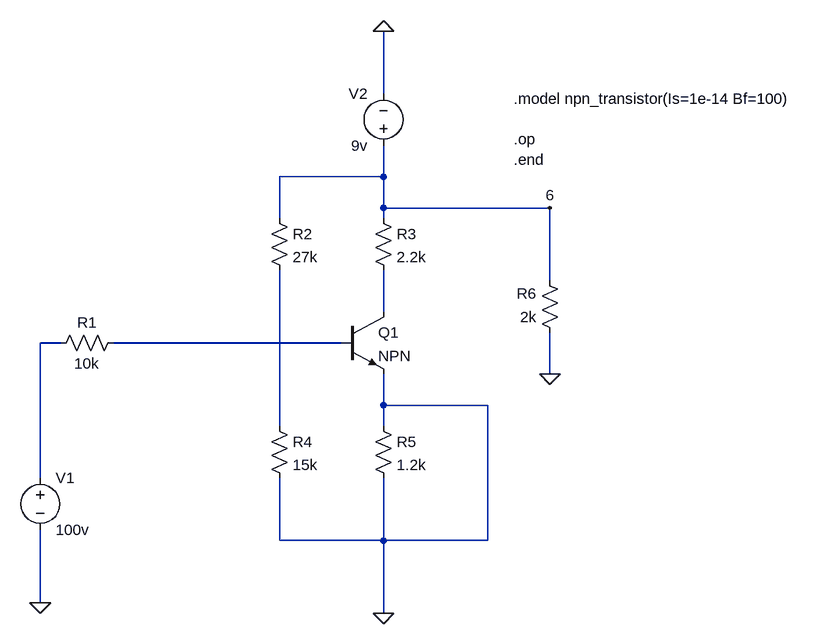
[diagram p0: schematic QUEST4.8.asc]
QUEST4.8.asc, the LTspice schematic file:
Version 4
SHEET 1 1240 680
WIRE 592 -240 592 -336
WIRE 592 -112 592 -160
WIRE 592 -112 432 -112
WIRE 592 -64 592 -112
WIRE 848 -64 592 -64
WIRE 432 -48 432 -112
WIRE 592 -48 592 -64
WIRE 848 48 848 -64
WIRE 592 96 592 32
WIRE 96 144 64 144
WIRE 528 144 176 144
WIRE 848 192 848 128
WIRE 592 240 592 192
WIRE 752 240 592 240
WIRE 432 272 432 32
WIRE 592 272 592 240
WIRE 64 352 64 144
WIRE 432 448 432 352
WIRE 592 448 592 352
WIRE 592 448 432 448
WIRE 752 448 752 240
WIRE 752 448 592 448
WIRE 64 544 64 432
WIRE 592 560 592 448
FLAG 592 -336 0
FLAG 592 560 0
FLAG 848 192 0
FLAG 64 544 0
FLAG 848 -64 6
SYMBOL res 192 128 R90
WINDOW 0 0 56 VBottom 2
WINDOW 3 32 56 VTop 2
SYMATTR InstName R1
SYMATTR Value 10k
SYMBOL res 416 -64 R0
SYMATTR InstName R2
SYMATTR Value 27k
SYMBOL res 576 -64 R0
SYMATTR InstName R3
SYMATTR Value 2.2k
SYMBOL res 416 256 R0
SYMATTR InstName R4
SYMATTR Value 15k
SYMBOL res 576 256 R0
SYMATTR InstName R5
SYMATTR Value 1.2k
SYMBOL npn 528 96 R0
SYMATTR InstName Q1
SYMBOL res 864 144 R180
WINDOW 0 36 76 Left 2
WINDOW 3 36 40 Left 2
SYMATTR InstName R6
SYMATTR Value 2k
SYMBOL voltage 64 336 R0
WINDOW 123 0 0 Left 2
WINDOW 39 0 0 Left 2
SYMATTR InstName V1
SYMATTR Value 100v
SYMBOL voltage 592 -144 R180
WINDOW 0 24 96 Left 2
WINDOW 3 24 16 Left 2
WINDOW 123 0 0 Left 2
WINDOW 39 0 0 Left 2
SYMATTR InstName V2
SYMATTR Value 9v
TEXT 792 -232 Left 2 !.model npn_transistor(Is=1e-14 Bf=100)\n \n.op\n.end

The netlist it stands for:
* QUEST4.8.asc
R1 N003 N002 10k
R2 6 N004 27k
R3 6 N001 2.2k
R4 N004 0 15k
R5 0 0 1.2k
Q1 N001 N003 0 0 NPN
R6 0 6 2k
V1 N002 0 100v
V2 6 0 9v
.model NPN NPN
.model PNP PNP
.lib standard.bjt
.model npn_transistor(Is=1e-14 Bf=100)
.op
.end
.backanno
.end